# Altium schematic sheet vesc_drv8301.SchDoc
size A4; SheetNumber: 3; SheetTotal: 5
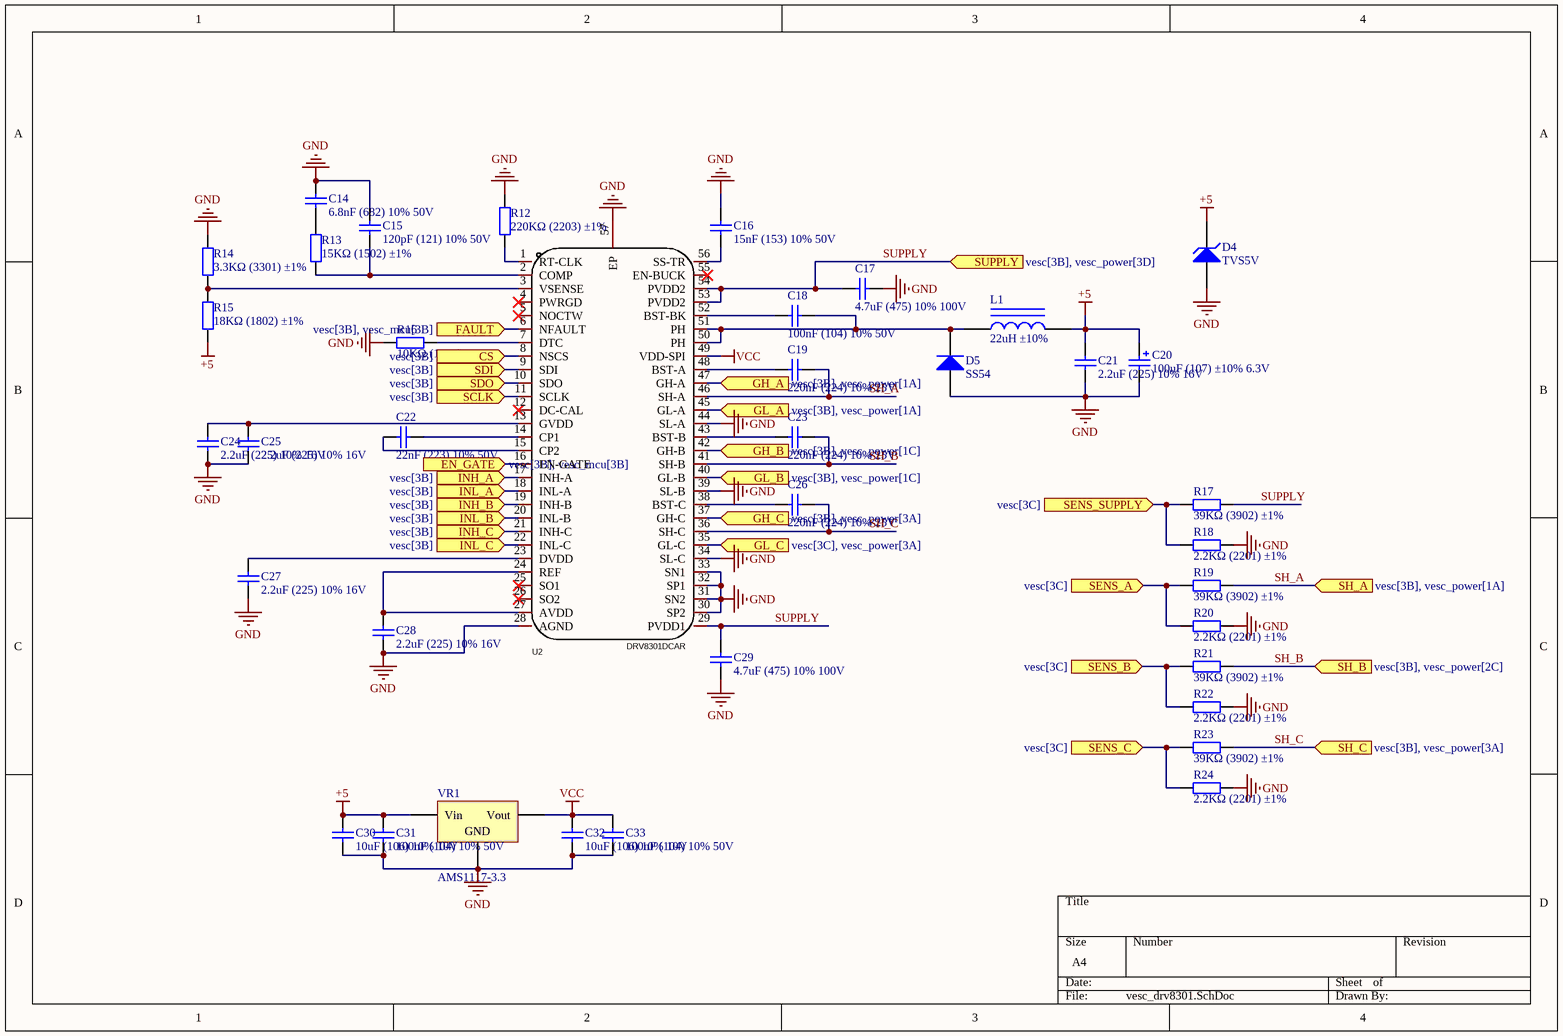
[diagram p0: vesc_drv8301.SchDoc]

## Parts
C14  6.8nF (682) 10% 50V  [0603_C]
C15  120pF (121) 10% 50V  [0603_C]
C16  15nF (153) 10% 50V  [0603_C]
C17  4.7uF (475) 10% 100V  [1210_C]
C18  100nF (104) 10% 50V  [0603_C]
C19  220nF (224) 10% 25V  [0603_C]
C20  100uF (107) ±10% 6.3V  [CASE-B_3528]
C21  2.2uF (225) 10% 16V  [0603_C]
C22  22nF (223) 10% 50V  [0603_C]
C23  220nF (224) 10% 25V  [0603_C]
C24  2.2uF (225) 10% 16V  [0603_C]
C25  2.2uF (225) 10% 16V  [0603_C]
C26  220nF (224) 10% 25V  [0603_C]
C27  2.2uF (225) 10% 16V  [0603_C]
C28  2.2uF (225) 10% 16V  [0603_C]
C29  4.7uF (475) 10% 100V  [1210_C]
C30  10uF (106) 10% 10V  [0603_C]
C31  100nF (104) 10% 50V  [0603_C]
C32  10uF (106) 10% 10V  [0603_C]
C33  100nF (104) 10% 50V  [0603_C]
D4  TVS5V  [SMA(DO-214AC)_S2]
D5  SS54  [SMA(DO-214AC)_S1]
L1  22uH ±10%  [IND-SMD_L7.3-W6.6]
R12  220KΩ (2203) ±1%  [0603_R]
R13  15KΩ (1502) ±1%  [0603_R]
R14  3.3KΩ (3301) ±1%  [0603_R]
R15  18KΩ (1802) ±1%  [0603_R]
R16  10KΩ (1002) ±1%  [0603_R]
R17  39KΩ (3902) ±1%  [0603_R]
R18  2.2KΩ (2201) ±1%  [0603_R]
R19  39KΩ (3902) ±1%  [0603_R]
R20  2.2KΩ (2201) ±1%  [0603_R]
R21  39KΩ (3902) ±1%  [0603_R]
R22  2.2KΩ (2201) ±1%  [0603_R]
R23  39KΩ (3902) ±1%  [0603_R]
R24  2.2KΩ (2201) ±1%  [0603_R]
U2  DRV8301DCAR  [HTSSOP-56_L14.0-W6.0-P0.50-LS8.0-BL]
VR1  AMS1117-3.3  [SOT-223]

## Ports
CS (in, see vesc[3B]), EN_GATE (in, see vesc[3B], vesc_mcu[3B]), FAULT (in, see vesc[3B], vesc_mcu[3B]), GH_A (in, see vesc[3B], vesc_power[1A]), GH_B (in, see vesc[3B], vesc_power[1C]), GH_C (in, see vesc[3B], vesc_power[3A]), GL_A (in, see vesc[3B], vesc_power[1A]), GL_B (in, see vesc[3B], vesc_power[1C]), GL_C (in, see vesc[3C], vesc_power[3A]), INH_A (in, see vesc[3B]), INH_B (in, see vesc[3B]), INH_C (in, see vesc[3B]), INL_A (in, see vesc[3B]), INL_B (in, see vesc[3B]), INL_C (in, see vesc[3B]), SCLK (in, see vesc[3B]), SDI (in, see vesc[3B]), SDO (in, see vesc[3B]), SENS_A (in, see vesc[3C]), SENS_B (in, see vesc[3C]), SENS_C (in, see vesc[3C]), SENS_SUPPLY (in, see vesc[3C]), SH_A (in, see vesc[3B], vesc_power[1A]), SH_B (in, see vesc[3B], vesc_power[2C]), SH_C (in, see vesc[3B], vesc_power[3A]), SUPPLY (in, see vesc[3B], vesc_power[3D])

## Nets
+5: C20.1 C21.2 C30.2 C31.2 D4.2(K) L1.2 R15.1 VR1.3(Vin)
GND: C14.2 C15.2 C16.2 C17.2 C20.2 C21.1 C24.1 C25.1 C27.1 C28.1 C29.1 C30.1 C31.1 C32.1 C33.1 D4.1(A) D5.1(A) R12.2 R14.2 R16.1 R18.2 R20.2 R22.2 R24.2 U2.28(AGND) U2.30(SP2) U2.31(SN2) U2.32(SP1) U2.33(SN1) U2.34(SL-C) U2.39(SL-B) U2.44(SL-A) U2.57(EP) VR1.1(GND)
VCC: C32.2 C33.2 U2.49(VDD-SPI) VR1.2(Vout)
CS: U2.8(NSCS) ; port CS
EN_GATE: U2.16(EN-GATE) ; port EN_GATE
FAULT: U2.6(NFAULT) ; port FAULT
GH_A: U2.47(GH-A) ; port GH_A
GH_B: U2.42(GH-B) ; port GH_B
GH_C: U2.37(GH-C) ; port GH_C
GL_A: U2.45(GL-A) ; port GL_A
GL_B: U2.40(GL-B) ; port GL_B
GL_C: U2.35(GL-C) ; port GL_C
INH_A: U2.17(INH-A) ; port INH_A
INH_B: U2.19(INH-B) ; port INH_B
INH_C: U2.21(INH-C) ; port INH_C
INL_A: U2.18(INL-A) ; port INL_A
INL_B: U2.20(INL-B) ; port INL_B
INL_C: U2.22(INL-C) ; port INL_C
SCLK: U2.11(SCLK) ; port SCLK
SDI: U2.9(SDI) ; port SDI
SDO: U2.10(SDO) ; port SDO
SENS_A: R19.1 R20.1 ; port SENS_A
SENS_B: R21.1 R22.1 ; port SENS_B
SENS_C: R23.1 R24.1 ; port SENS_C
SENS_SUPPLY: R17.1 R18.1 ; port SENS_SUPPLY
SH_A: C19.2 R19.2 U2.46(SH-A) ; port SH_A
SH_B: C23.2 R21.2 U2.41(SH-B) ; port SH_B
SH_C: C26.2 R23.2 U2.36(SH-C) ; port SH_C
SUPPLY: C17.1 C29.2 R17.2 U2.29(PVDD1) U2.53(PVDD2) U2.54(PVDD2) ; port SUPPLY
NetC14_1: C14.1 R13.2
NetC15_1: C15.1 R13.1 U2.2(COMP)
NetC16_1: C16.1 U2.56(SS-TR)
NetC18_1: C18.1 U2.52(BST-BK)
NetC18_2: C18.2 D5.2(K) L1.1 U2.50(PH) U2.51(PH)
NetC19_1: C19.1 U2.48(BST-A)
NetC22_1: C22.1 U2.15(CP2)
NetC22_2: C22.2 U2.14(CP1)
NetC23_1: C23.1 U2.43(BST-B)
NetC24_2: C24.2 C25.2 U2.13(GVDD)
NetC26_1: C26.1 U2.38(BST-C)
NetC27_2: C27.2 U2.23(DVDD)
NetC28_2: C28.2 U2.24(REF) U2.27(AVDD)
NetR12_1: R12.1 U2.1(RT-CLK)
NetR14_1: R14.1 R15.2 U2.3(VSENSE)
NetR16_2: R16.2 U2.7(DTC)

Not connected (* = marked no-connect by the designer): U2 4(PWRGD)* 5(NOCTW)* 12(DC-CAL)* 25(SO1)* 26(SO2)* 55(EN-BUCK)*

## Library data of the parts
C14 = 0603 6.8nF (682) 10% 50V: 贴片电容; ComponentLink1Description: 供应商链接; ComponentLink1URL: http://www.szlcsc.com/product/details_1983.html; Package: 0603; Supplier: LC; SuppliersPartNumber: C1631
C15 = 0603 150pF (151) 10% 50V: 贴片电容; ComponentLink1Description: 供应商链接; ComponentLink1URL: http://www.szlcsc.com/product/details_1946.html; Package: 0603; Supplier: LC; SuppliersPartNumber: C1594
C16 = 0603 15nF (153) 10% 50V: 贴片电容; ComponentLink1Description: 供应商链接; ComponentLink1URL: http://www.szlcsc.com/product/details_1948.html; Package: 0603; Supplier: LC; SuppliersPartNumber: C1596
C17 C29 = 1206 4.7uF (475) 10% 50V: 贴片电容; ComponentLink1Description: 供应商链接; ComponentLink1URL: http://www.szlcsc.com/product/details_30577.html; Package: 1206; Supplier: LC; SuppliersPartNumber: C29823
C18 C31 C33 = 0603 100nF (104) 10% 50V: 贴片电容; ComponentLink1Description: 供应商链接; ComponentLink1URL: http://www.szlcsc.com/product/details_15331.html; Package: 0603; Supplier: LC; SuppliersPartNumber: C14663
C19 C23 C26 = 0603 220nF (224) 10% 25V: 贴片电容; ComponentLink1Description: 供应商链接; ComponentLink1URL: http://www.szlcsc.com/product/details_21832.html; Package: 0603; Supplier: LC; SuppliersPartNumber: C21120
C20 = 3528 100uF (107) 10% 6.3V: 钽电容; ComponentLink1Description: 供应商链接; ComponentLink1URL: http://www.szlcsc.com/product/details_16815.html; Package: 3528; Supplier: LC; SuppliersPartNumber: C16133
C21 C24 C25 C27 C28 = 0603 2.2uF (225) 10% 16V: 贴片电容; ComponentLink1Description: 供应商链接; ComponentLink1URL: http://www.szlcsc.com/product/details_24366.html; Package: 0603; Supplier: LC; SuppliersPartNumber: C23630
C22 = 0603 22nF (223) 10% 50V: 贴片电容; ComponentLink1Description: 供应商链接; ComponentLink1URL: http://www.szlcsc.com/product/details_21834.html; Package: 0603; Supplier: LC; SuppliersPartNumber: C21122
C30 C32 = 0603 10uF (106) 10% 10V: 贴片电容; ComponentLink1Description: 供应商链接; ComponentLink1URL: http://www.szlcsc.com/product/details_20411.html; Package: 0603; Supplier: LC; SuppliersPartNumber: C19702
D4 = LL-34 ZMM5V6: 稳压二极管; ComponentLink1Description: 供应商链接; ComponentLink1URL: http://www.szlcsc.com/product/details_8541.html; Package: LL-34; Supplier: LC; SuppliersPartNumber: C8062
D5 = SMA(DO-214AC) SS54: 二极管; ComponentLink1Description: 供应商链接; ComponentLink1URL: http://www.szlcsc.com/product/details_23178.html; Package: SMA(DO-214AC); Supplier: LC; SuppliersPartNumber: C22452
L1 = 0805 22uH 10%: 贴片电感; ComponentLink1Description: 供应商链接; ComponentLink1URL: http://www.szlcsc.com/product/details_33340.html; Package: 0805; Supplier: LC; SuppliersPartNumber: C32375
R12 = 0603 220KΩ (2203) 1%: 贴片电阻; ComponentLink1Description: 供应商链接; ComponentLink1URL: http://www.szlcsc.com/product/details_23688.html; Package: 0603; Supplier: LC; SuppliersPartNumber: C22961
R13 = 0603 15KΩ (1502) 1%: 贴片电阻; ComponentLink1Description: 供应商链接; ComponentLink1URL: http://www.szlcsc.com/product/details_23536.html; Package: 0603; Supplier: LC; SuppliersPartNumber: C22809
R14 = 0603 3.3KΩ (3301) 1%: 贴片电阻; ComponentLink1Description: 供应商链接; ComponentLink1URL: http://www.szlcsc.com/product/details_23705.html; Package: 0603; Supplier: LC; SuppliersPartNumber: C22978
R15 = 0603 18KΩ (1802) 1%: 贴片电阻; ComponentLink1Description: 供应商链接; ComponentLink1URL: http://www.szlcsc.com/product/details_26553.html; Package: 0603; Supplier: LC; SuppliersPartNumber: C25810
R16 = 0603 10KΩ (1002) 1%: 贴片电阻; ComponentLink1Description: 供应商链接; ComponentLink1URL: http://www.szlcsc.com/product/details_26547.html; Package: 0603; Supplier: LC; SuppliersPartNumber: C25804
R17 R19 R21 R23 = 0603 39KΩ (3902) 1%: 贴片电阻; ComponentLink1Description: 供应商链接; ComponentLink1URL: http://www.szlcsc.com/product/details_23880.html; Package: 0603; Supplier: LC; SuppliersPartNumber: C23153
R18 R20 R22 R24 = 0603 2.2KΩ (2201) 1%: 贴片电阻; ComponentLink1Description: 供应商链接; ComponentLink1URL: http://www.szlcsc.com/product/details_4597.html; Package: 0603; Supplier: LC; SuppliersPartNumber: C4190
U2 = DRV8301DCAR: Manufacturer: TI(德州仪器); Add into BOM: yes; Name: DRV8301DCAR; Symbol: DRV8301DCAR; Device: DRV8301DCAR; LCSC Part Name: 无刷直流BLDC电机驱动芯片 60V; Supplier Part: C98969; Manufacturer Part: DRV8301DCAR; Supplier Footprint: HTSSOP-56-6mm; JLCPCB Part Class: Extended Part; Datasheet: https://www.ti.com/cn/lit/gpn/drv8301; Supplier: LCSC; Convert to PCB: yes
VR1 = SOT-223 AMS1117-3.3: 低压差线性稳压(LDO); ComponentLink1Description: 供应商链接; ComponentLink1URL: http://www.szlcsc.com/product/details_6652.html; Package: SOT-223; Supplier: LC; SuppliersPartNumber: C6186